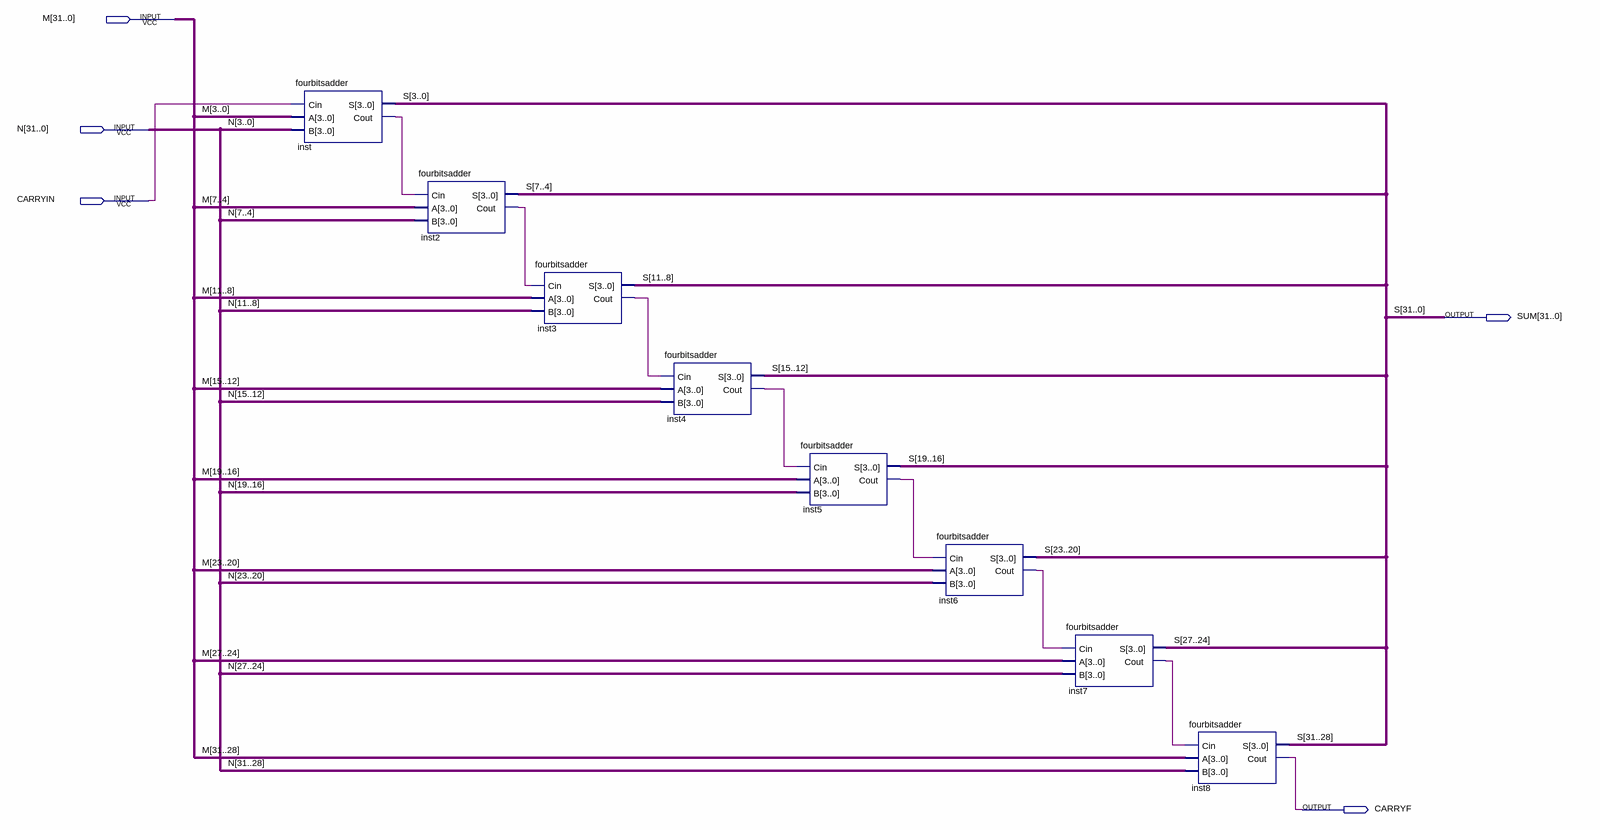
[diagram p0: schematic sheet]
// Quartus schematic adder32bitTWO.bdf as structural Verilog: 8 symbols, 5 pins
module adder32bitTWO (
  input  [31:0] M,
  input  [31:0] N,
  input  CARRYIN,
  output [31:0] SUM,
  output CARRYF
);

  wire inst2_cout, inst3_cout, inst4_cout, inst5_cout, inst6_cout, inst7_cout, inst_cout;

  fourbitsadder inst (.Cin(CARRYIN), .A(M[3:0]), .B(N[3:0]), .S(SUM[3:0]), .Cout(inst_cout));
  fourbitsadder inst2 (.Cin(inst_cout), .A(M[7:4]), .B(N[7:4]), .S(SUM[7:4]), .Cout(inst2_cout));
  fourbitsadder inst3 (.Cin(inst2_cout), .A(M[11:8]), .B(N[11:8]), .S(SUM[11:8]), .Cout(inst3_cout));
  fourbitsadder inst4 (.Cin(inst3_cout), .A(M[15:12]), .B(N[15:12]), .S(SUM[15:12]), .Cout(inst4_cout));
  fourbitsadder inst5 (.Cin(inst4_cout), .A(M[19:16]), .B(N[19:16]), .S(SUM[19:16]), .Cout(inst5_cout));
  fourbitsadder inst6 (.Cin(inst5_cout), .A(M[23:20]), .B(N[23:20]), .S(SUM[23:20]), .Cout(inst6_cout));
  fourbitsadder inst7 (.Cin(inst6_cout), .A(M[27:24]), .B(N[27:24]), .S(SUM[27:24]), .Cout(inst7_cout));
  fourbitsadder inst8 (.Cin(inst7_cout), .A(M[31:28]), .B(N[31:28]), .S(SUM[31:28]), .Cout(CARRYF));

  // Other names for the same wires on the sheet: S[31:0] = SUM
endmodule
